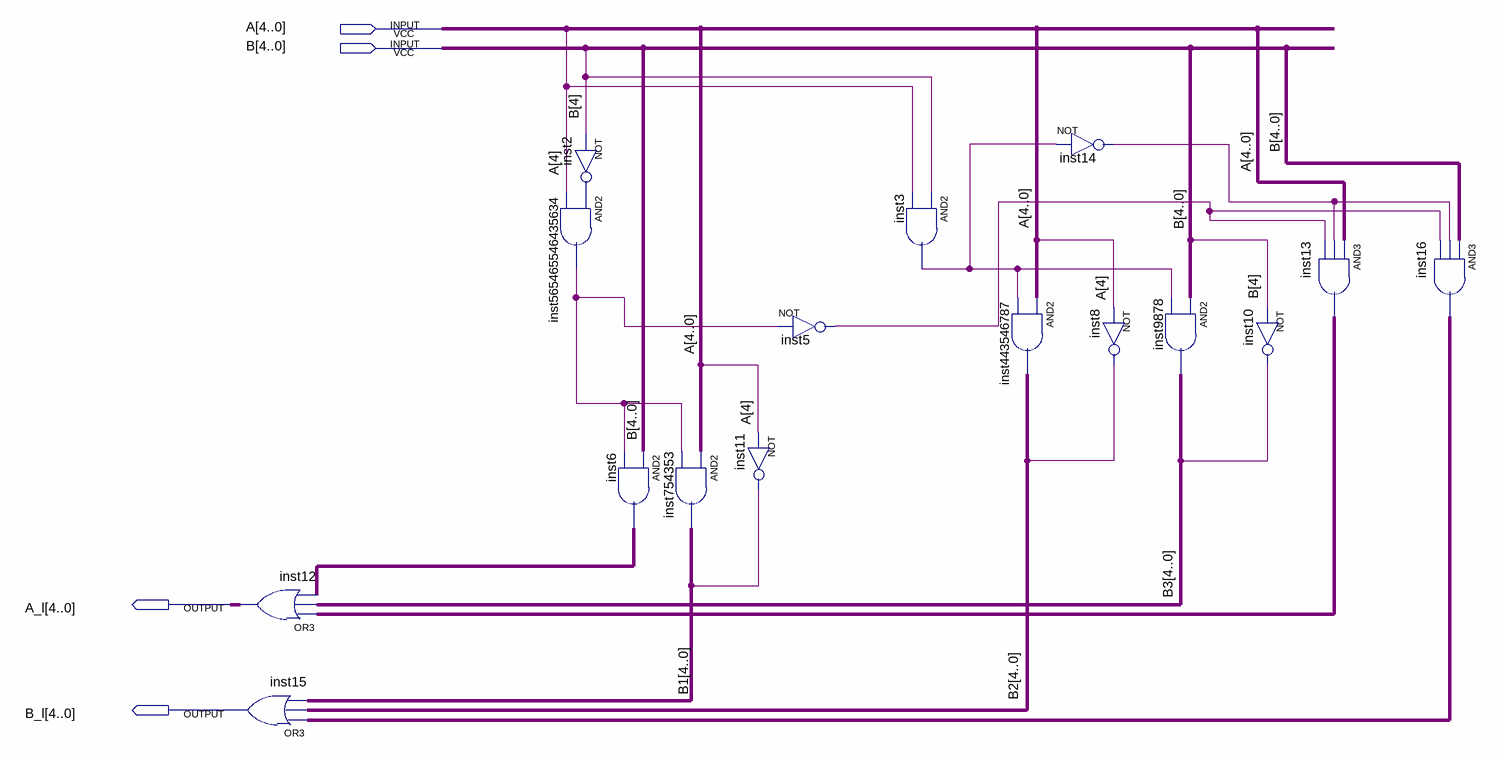
[diagram p0: schematic sheet]
// Quartus schematic set_v.bdf as structural Verilog: 16 symbols, 4 pins
module set_v (
  input  [4:0] A,
  input  [4:0] B,
  output [4:0] A_l,
  output [4:0] B_l
);

  wire inst2_out, inst3_out, inst5_out, inst8_out, inst10_out, inst11_out, inst14_out,
       inst565465546435634_out;
  wire [4:0] B1, B2, B3, inst6_out, inst13_out, inst16_out;

  assign A_l = inst13_out | B3 | inst6_out;  // OR3 inst12, 5 bits wide
  assign B_l = inst16_out | B2 | B1;  // OR3 inst15, 5 bits wide
  not inst2 (inst2_out, B[4]);
  and inst565465546435634 (inst565465546435634_out, inst2_out, A[4]);
  assign inst6_out = B & {5{inst565465546435634_out}};  // AND2 inst6, 5 bits wide
  assign B1 = A & {5{inst565465546435634_out}};  // AND2 inst754353, 5 bits wide
  not inst11 (inst11_out, A[4]);
  not inst5 (inst5_out, inst565465546435634_out);
  and inst3 (inst3_out, B[4], A[4]);
  not inst14 (inst14_out, inst3_out);
  assign B2 = A & {5{inst3_out}};  // AND2 inst443546787, 5 bits wide
  not inst8 (inst8_out, A[4]);
  assign B3 = B & {5{inst3_out}};  // AND2 inst9878, 5 bits wide
  not inst10 (inst10_out, B[4]);
  assign inst13_out = A & {5{inst14_out}} & {5{inst5_out}};  // AND3 inst13, 5 bits wide
  assign inst16_out = B & {5{inst14_out}} & {5{inst5_out}};  // AND3 inst16, 5 bits wide
endmodule
